# Altium project BikeLogger.PrjPcb
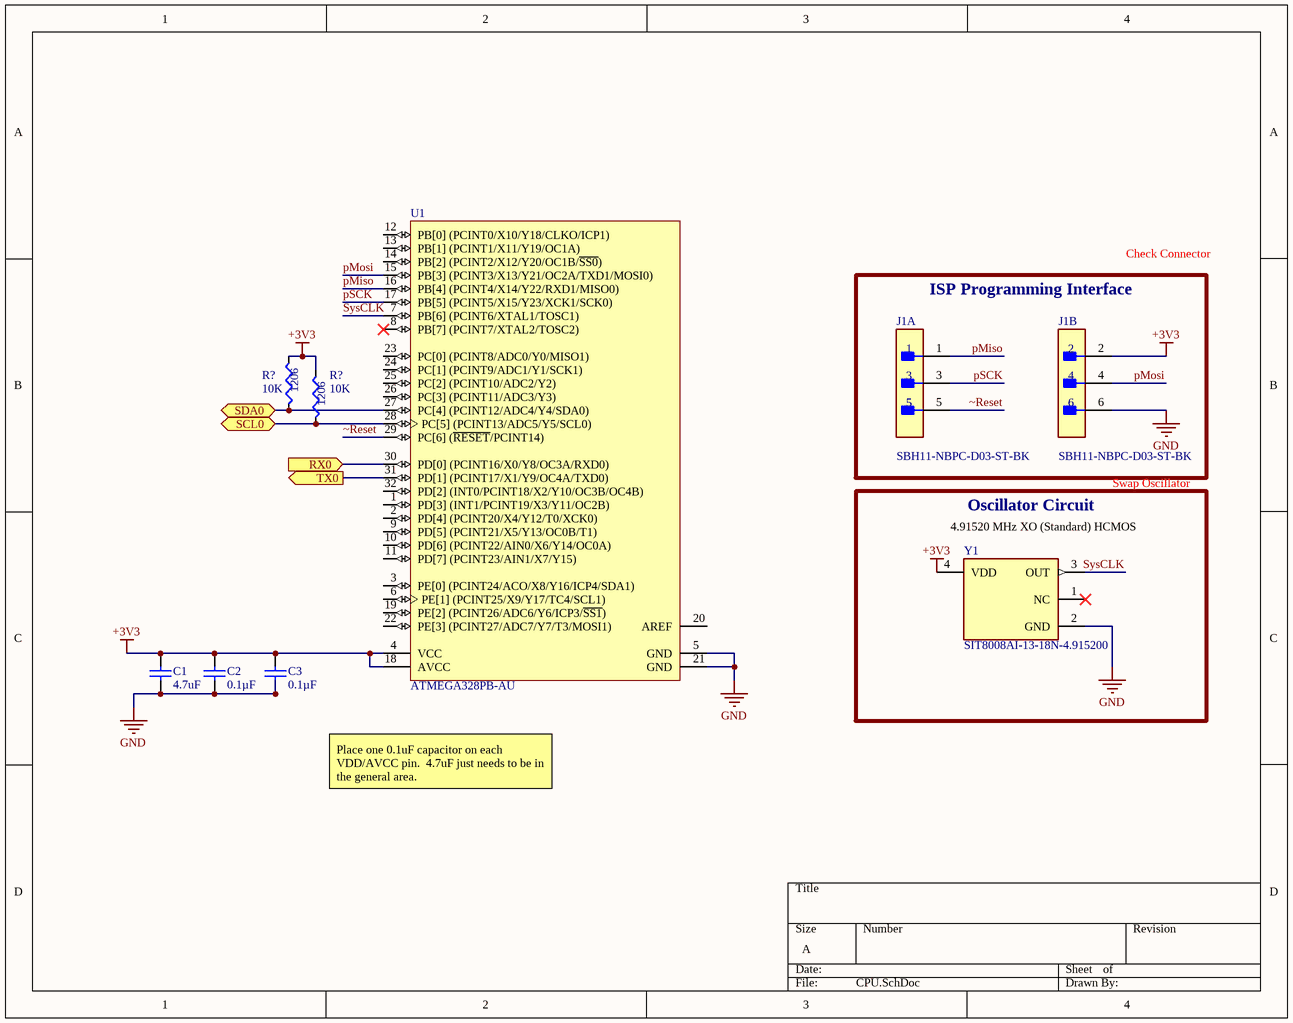
[diagram p0: CPU.SchDoc]
8 sheets, 65 parts. Net scope: flat (ports and power ports of the same name join across sheets).
Sheets:
  CPU.SchDoc
  3v3Regulator.SchDoc
  5VRegulator.SchDoc
  BikeLoggerTop.SchDoc
  Connectors.SchDoc
  DebouncedButtons.SchDoc
  GPS.SchDoc
  LEDs.SchDoc

## Sheet CPU.SchDoc
size A; SheetNumber: 2; SheetTotal: 8

### Parts
(Parts that share a designator on the sheet are numbered #1, #2 ... from top to bottom, then left to right.)
C1  4.7uF  [C1206]
C2  0.1µF  [C0603]
C3  0.1µF  [C0603]
J1  SBH11-NBPC-D03-ST-BK  [FP-SBH11-NBPC-D03-ST-BK-MFG]  (parts A,B of 2)
R?#1  10K  [R1206]
R?#2  10K  [R1206]
U1  ATMEGA328PB-AU  [ATML-32A_L]
Y1  SIT8008AI-13-18N-4.915200  [FP-SIT8008-1-MFG]

### Blocks framed on the sheet
ISP Programming Interface: J1
Oscillator Circuit: Y1

### Ports
RX0 (in), SCL0 (bidir), SDA0 (bidir), TX0 (out)

### Nets
+3V3: C1.2 C2.2 C3.2 J1.2 R?#1.2 R?#2.2 U1.4(VCC) U1.18(AVCC) Y1.4(VDD)
GND: C1.1 C2.1 C3.1 J1.6 U1.5(GND) U1.21(GND) Y1.2(GND)
pMiso: J1.1 U1.16(PB[4]_(PCINT4/X14/Y22/RXD1/MISO0))
pMosi: J1.4 U1.15(PB[3]_(PCINT3/X13/Y21/OC2A/TXD1/MOSI0))
pSCK: J1.3 U1.17(PB[5]_(PCINT5/X15/Y23/XCK1/SCK0))
SysCLK: U1.7(PB[6]_(PCINT6/XTAL1/TOSC1)) Y1.3(OUT)
~Reset: J1.5 U1.29(PC[6]_(~{RESET}/PCINT14))
NetR?#1_1: R?#1.1 U1.27(PC[4]_(PCINT12/ADC4/Y4/SDA0)) ; port SDA0
NetR?#2_1: R?#2.1 U1.28(PC[5]_(PCINT13/ADC5/Y5/SCL0)) ; port SCL0
NetU1_30: U1.30(PD[0]_(PCINT16/X0/Y8/OC3A/RXD0)) ; port RX0
NetU1_31: U1.31(PD[1]_(PCINT17/X1/Y9/OC4A/TXD0)) ; port TX0

Not connected (* = marked no-connect by the designer): U1 1(PD[3]_(INT1/PCINT19/X3/Y11/OC2B)) 2(PD[4]_(PCINT20/X4/Y12/T0/XCK0)) 3(PE[0]_(PCINT24/ACO/X8/Y16/ICP4/SDA1)) 6(PE[1]_(PCINT25/X9/Y17/TC4/SCL1)) 8(PB[7]_(PCINT7/XTAL2/TOSC2))* 9(PD[5]_(PCINT21/X5/Y13/OC0B/T1)) 10(PD[6]_(PCINT22/AIN0/X6/Y14/OC0A)) 11(PD[7]_(PCINT23/AIN1/X7/Y15)) 12(PB[0]_(PCINT0/X10/Y18/CLKO/ICP1)) 13(PB[1]_(PCINT1/X11/Y19/OC1A)) 14(PB[2]_(PCINT2/X12/Y20/OC1B/~{SS0})) 19(PE[2]_(PCINT26/ADC6/Y6/ICP3/~{SS1})) 20(AREF) 22(PE[3]_(PCINT27/ADC7/Y7/T3/MOSI1)) 23(PC[0]_(PCINT8/ADC0/Y0/MISO1)) 24(PC[1]_(PCINT9/ADC1/Y1/SCK1)) 25(PC[2]_(PCINT10/ADC2/Y2)) 26(PC[3]_(PCINT11/ADC3/Y3)) 32(PD[2]_(INT0/PCINT18/X2/Y10/OC3B/OC4B)); Y1 1(NC)*

### Notes on the sheet
- Check Connector
- Swap Oscillator
- (near Y1) 4.91520 MHz XO (Standard) HCMOS
- Place one 0.1uF capacitor on each VDD/AVCC pin.  4.7uF just needs to be in the general area.
- (in symbol CMP-024-000007-3) 1206

### Library data of the parts
C1 = CL31B475KBHNNNE: CER 4.7uF 50V X7R 1206; Made By: Brennan Swanton; Reviewed By: Carter Allen; Supplier 1: Digi-Key; Supplier Part Number 1: 587-2994-1-ND
C2 C3 = ESD35C104K4T2A-24: CAP CER 0.1UF 50V X7R 0603; Made By: Brennan Swanton; Reviewed By: *; Supplier 1: Digi-Key; Supplier Part Number 1: 478-8009-1-ND
J1 = CMP-00595-33729071-1: SBH11-NBPC-D03-ST-BK Conn Header Vert 6POS 2.54MM; Number of Contacts: 6; Connector Type: Male Pin; Current Rating: 3A; Height: 9.3mm; Row Spacing: 2.54mm; NexarPartId: 33729071; Max Operating Temperature: 105°C; RoHS: Compliant; Color: Black; Termination: Solder; Mount: Through Hole; Contact Material: Gold, Nickel; Contact Plating: Gold; Number of Rows: 2; Min Operating Temperature: -40°C; Number of Positions: 6; Pitch: 2.54mm
R?#1 R?#2 = CMP-024-000007-3: RES SMD 10K OHM 0.1% 1/4W 1206; Made By: Rita Yang; Source: Resistors.SchLib; Design Item ID: ERA-8AEB103V
U1 = CMP-2000-07439-1: AVR Microcontroller, 1.8 to 5.5 V, 32 KB Flash, 1 KB EEPROM, 2 KB SRAM, -40 to 85 degC, 32-Pin TQFP (32A), RoHS, Tray; Manufacturer: Microchip; Datasheet URL: http://ww1.microchip.com/downloads/en/DeviceDoc/40001906A.pdf; Mounting Technology: SurfaceMount; RoHSCompliant: false; Manufacturer URL: http://www.microchip.com/; Package Description: 32-Pin Thin Profile Plastic Quad Flat Package, Body 7 x 7 mm, Pitch 0.8 mm; Package Reference: 32A; Datasheet Version: Rev. A, 04/2017
Y1 = CMP-25159-009738-1: 4.91520 MHz XO (Standard) HCMOS, LVCMOS Oscillator 1.8V No Connect 4-SMD, No Lead; Manufacturer: SiTime; Max Junction Temp: +150°C; Nominal Supply Current: 3.8mA; Min Supply Voltage: 1.62V; Max Supply Voltage: 1.98V; temperature_range: Industrial, -40 to 85°C; output_drive_strength: Default; frequency_stability: ±50 ppm; voltage_supply: 1.8 V ±10%; package_size: 2.5 x 2.0 mm; Temperature Range Low: -40°C; Category: Crys; Height: 0.8mm; Package: SIT8008-1; ComponentLink2Description: Datasheet; Manufacturer Part Number: SIT8008AI-13-18N-4.915200; revision: A; Frequency: 4.91520 MHz; Temperature: -40°C to +85°C; packaging: Bulk; feature_pin: No Connect; ComponentLink2URL: https://www.sitime.com/datasheet/SiT8008; RoHS: TRUE; Lead Free: Yes; Device Class L3: Timers and Oscillators; Octopart: https://octopart.com/sit8008ai-13-18n-4.915200-sitime-102635591; Automotive: No; Temperature Range High: +85°C; octopart_url: https://octopart.com/sit8008ai-13-18n-4.915200-sitime-102635591; Device Class L1: Integrated Circuits (ICs); Device Class L2: Clock and Timing; nominal_supply_voltage: 1.8V

## Sheet 3v3Regulator.SchDoc
size B; SheetNumber: 5; SheetTotal: 6
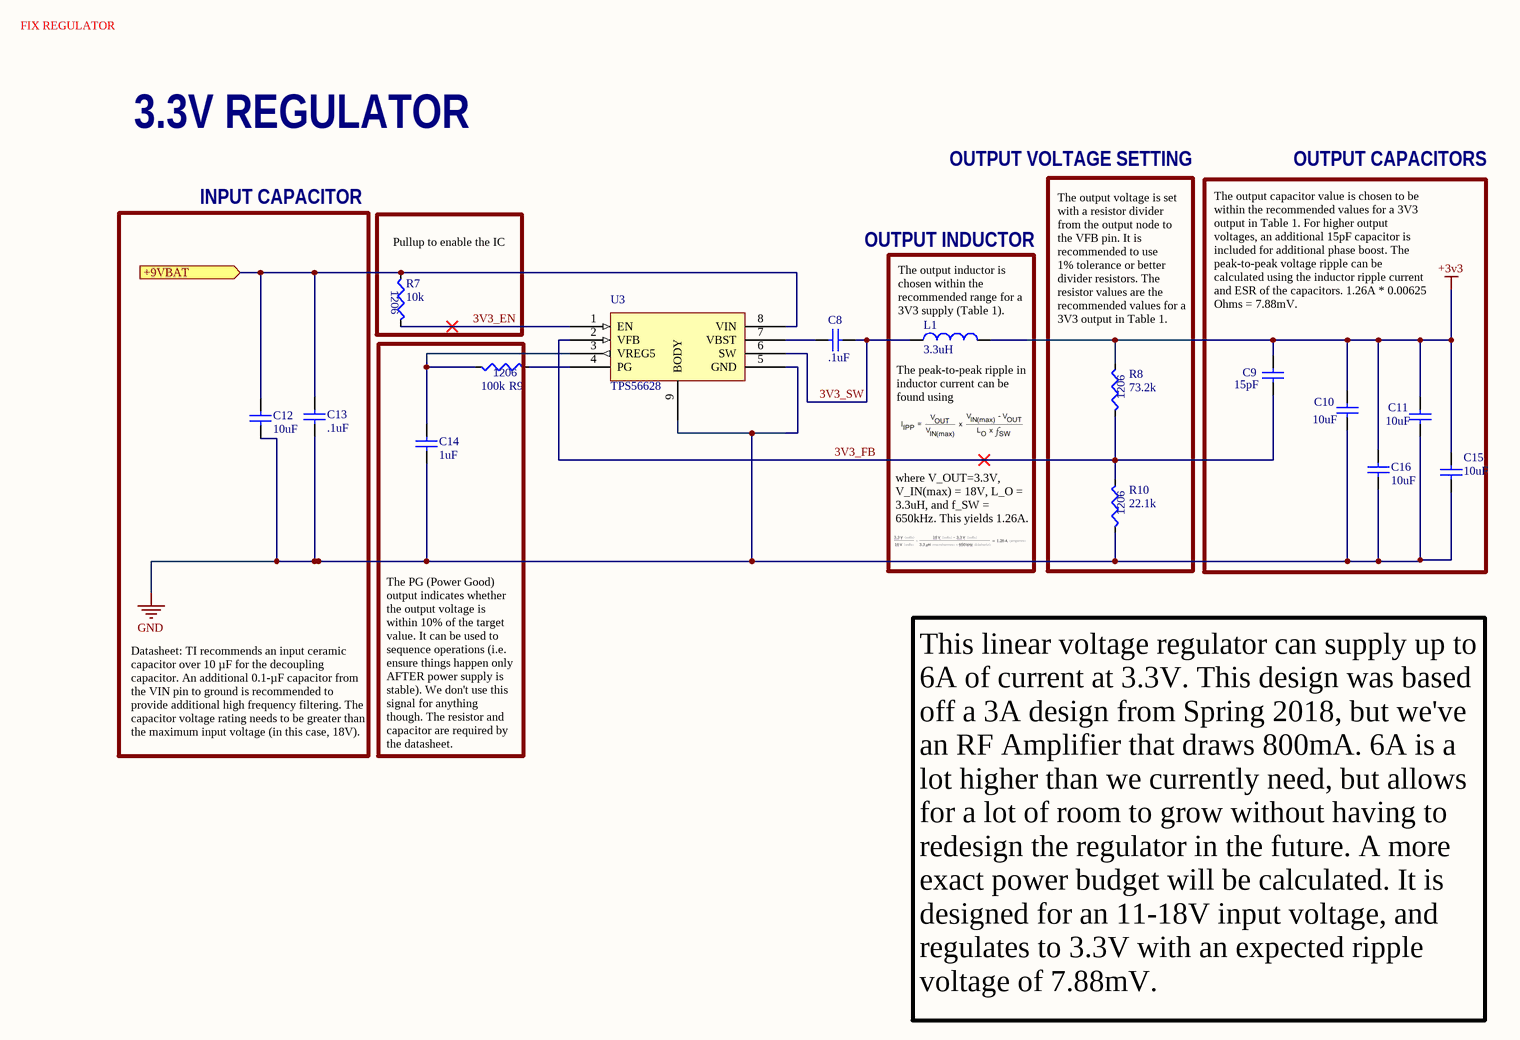
[diagram p1: 3v3Regulator.SchDoc]

### Parts
C8  .1uF  [C1206]
C9  15pF  [C1206]
C10  10uF  [C1206]
C11  10uF  [C1206]
C12  10uF  [C1206]
C13  .1uF  [C1206]
C14  1uF  [C1206]
C15  10uF  [C1206]
C16  10uF  [C1206]
L1  3.3uH  [EATON_DR125]
R7  10k  [R1206]
R8  73.2k  [R1206]
R9  100k  [R1206]
R10  22.1k  [R1206]
U3  TPS56628  [R-PDSO-G8]

### Blocks framed on the sheet
OUTPUT CAPACITORS: C9-C11 C15 C16
INPUT CAPACITOR: C12 C13

### Ports
+9VBAT (in)

### Nets
+3V3: C9.2 C10.2 C11.2 C15.2 C16.2 L1.2 R8.2
GND: C10.1 C11.1 C12.1 C13.1 C14.1 C15.1 C16.1 R10.1 U3.5(GND) U3.9(BODY)
3V3_EN: R7.2 U3.1(EN)
3V3_FB: C9.1 R8.1 R10.2 U3.2(VFB)
3V3_SW: C8.1 L1.1 U3.6(SW)
NetC8_2: C8.2 U3.7(VBST)
NetC12_2: C12.2 C13.2 R7.1 U3.8(VIN) ; port +9VBAT
NetC14_2: C14.2 R9.1 U3.3(VREG5)
NetR9_2: R9.2 U3.4(PG)

### Notes on the sheet
- FIX REGULATOR
- 3.3V REGULATOR
- OUTPUT VOLTAGE SETTING
- (near R7) Pullup to enable the IC
- OUTPUT INDUCTOR
- (near L1) The output inductor is chosen within the recommended range for a 3V3 supply (Table 1).
- (near R8) The output voltage is set with a resistor divider from the output node to the VFB pin. It is recommended to use
  1% tolerance or better divider resistors. The resistor values are the recommended values for a 3V3 output in Table 1.
- (near C9) The output capacitor value is chosen to be within the recommended values for a 3V3 output in Table 1. For higher output voltages, an additional 15pF capacitor is included for additional phase boost. The peak-to-peak voltage ripple can be calculated using the inductor ripple current and ESR of the capacitors. 1.26A * 0.00625 Ohms = 7.88mV.
- (near L1) The peak-to-peak ripple in inductor current can be found using
- where V_OUT=3.3V, V_IN(max) = 18V, L_O = 3.3uH, and f_SW = 650kHz. This yields 1.26A.
- Datasheet: TI recommends an input ceramic capacitor over 10 µF for the decoupling capacitor. An additional 0.1-µF capacitor from the VIN pin to ground is recommended to provide additional high frequency filtering. The capacitor voltage rating needs to be greater than the maximum input voltage (in this case, 18V).
- The PG (Power Good) output indicates whether the output voltage is within 10% of the target value. It can be used to sequence operations (i.e. ensure things happen only AFTER power supply is stable). We don't use this signal for anything though. The resistor and capacitor are required by the datasheet.
- This linear voltage regulator can supply up to 6A of current at 3.3V. This design was based off a 3A design from Spring 2018, but we've an RF Amplifier that draws 800mA. 6A is a lot higher than we currently need, but allows for a lot of room to grow without having to redesign the regulator in the future. A more exact power budget will be calculated. It is designed for an 11-18V input voltage, and regulates to 3.3V with an expected ripple voltage of 7.88mV.
- (in symbol ERJ-8ENF1002V) 1206
- (in symbol ERJ-8ENF1003V) 1206
- (in symbol ERJ-8ENF2212V) 1206
- (in symbol ERJ-8ENF7322V) 1206

### Library data of the parts
C8 C13 = CL31B104KBCNNNC: CAP CER 0.1UF 50V C0G/NP0 1206; Made By: Brennan Swanton; Reviewed By: Carter Allen; Supplier 1: Digi-Key; Supplier Part Number 1: 490-8335-1-ND
C9 = C1206C150K5GACTU: CAP CER 15PF 50V C0G/NP0 1206; Supplier 1: Digi-Key; Supplier Part Number 1: 399-9314-1-ND
C10-C12 C15 C16 = CL31B106KLHNNNE: CER 10UF 35V X7R 1206; Made By: Brennan Swanton; Reviewed By: Carter Allen; Supplier 1: Digi-Key; Supplier Part Number 1: 587-3007-1-ND
C14 = CL31B105KBHNNNE: CER 1UF 50V X7R 1206; Made By: Brennan Swanton; Reviewed By: Carter Allen; Supplier 1: Digi-Key; Supplier Part Number 1: 399-8147-1-ND
L1 = DR125-3R3-R: Inductor 3.3uH 9.26A 20%; Supplier 1: Digi-Key; Supplier Part Number 1: 513-1529-1-ND
R7 = ERJ-8ENF1002V: 10K OHM 1% 1/4W 1206; Made By: Brennan Swanton; Reviewed By: Carter Allen; Supplier 1: Digi-Key; Supplier Part Number 1: 541-2247-1-ND
R8 = ERJ-8ENF7322V: 73.2K OHM 1% 1/4W 1206; Made By: Raphael Navarro; Reviewed By: No one, yet; Supplier 1: Digi-Key; Supplier Part Number 1: P73.2KFCT-ND
R9 = ERJ-8ENF1003V: 100K OHM 1% 1/4W 1206; Made By: Brennan Swanton; Reviewed By: Carter Allen; Supplier 1: Digi-Key; Supplier Part Number 1: P100KFCT-ND
R10 = ERJ-8ENF2212V: 22.1K OHM 1% 1/4W 1206; Supplier 1: Digi-Key; Supplier Part Number 1: P22.1KFCT-ND
U3 = TPS56628: Buck Regulator IC Adj. 6A 4.5V-18V Input; Supplier 1: Digi-Key; Supplier Part Number 1: 296-40815-1-ND

## Sheet 5VRegulator.SchDoc
size B; SheetNumber: 6; SheetTotal: 6
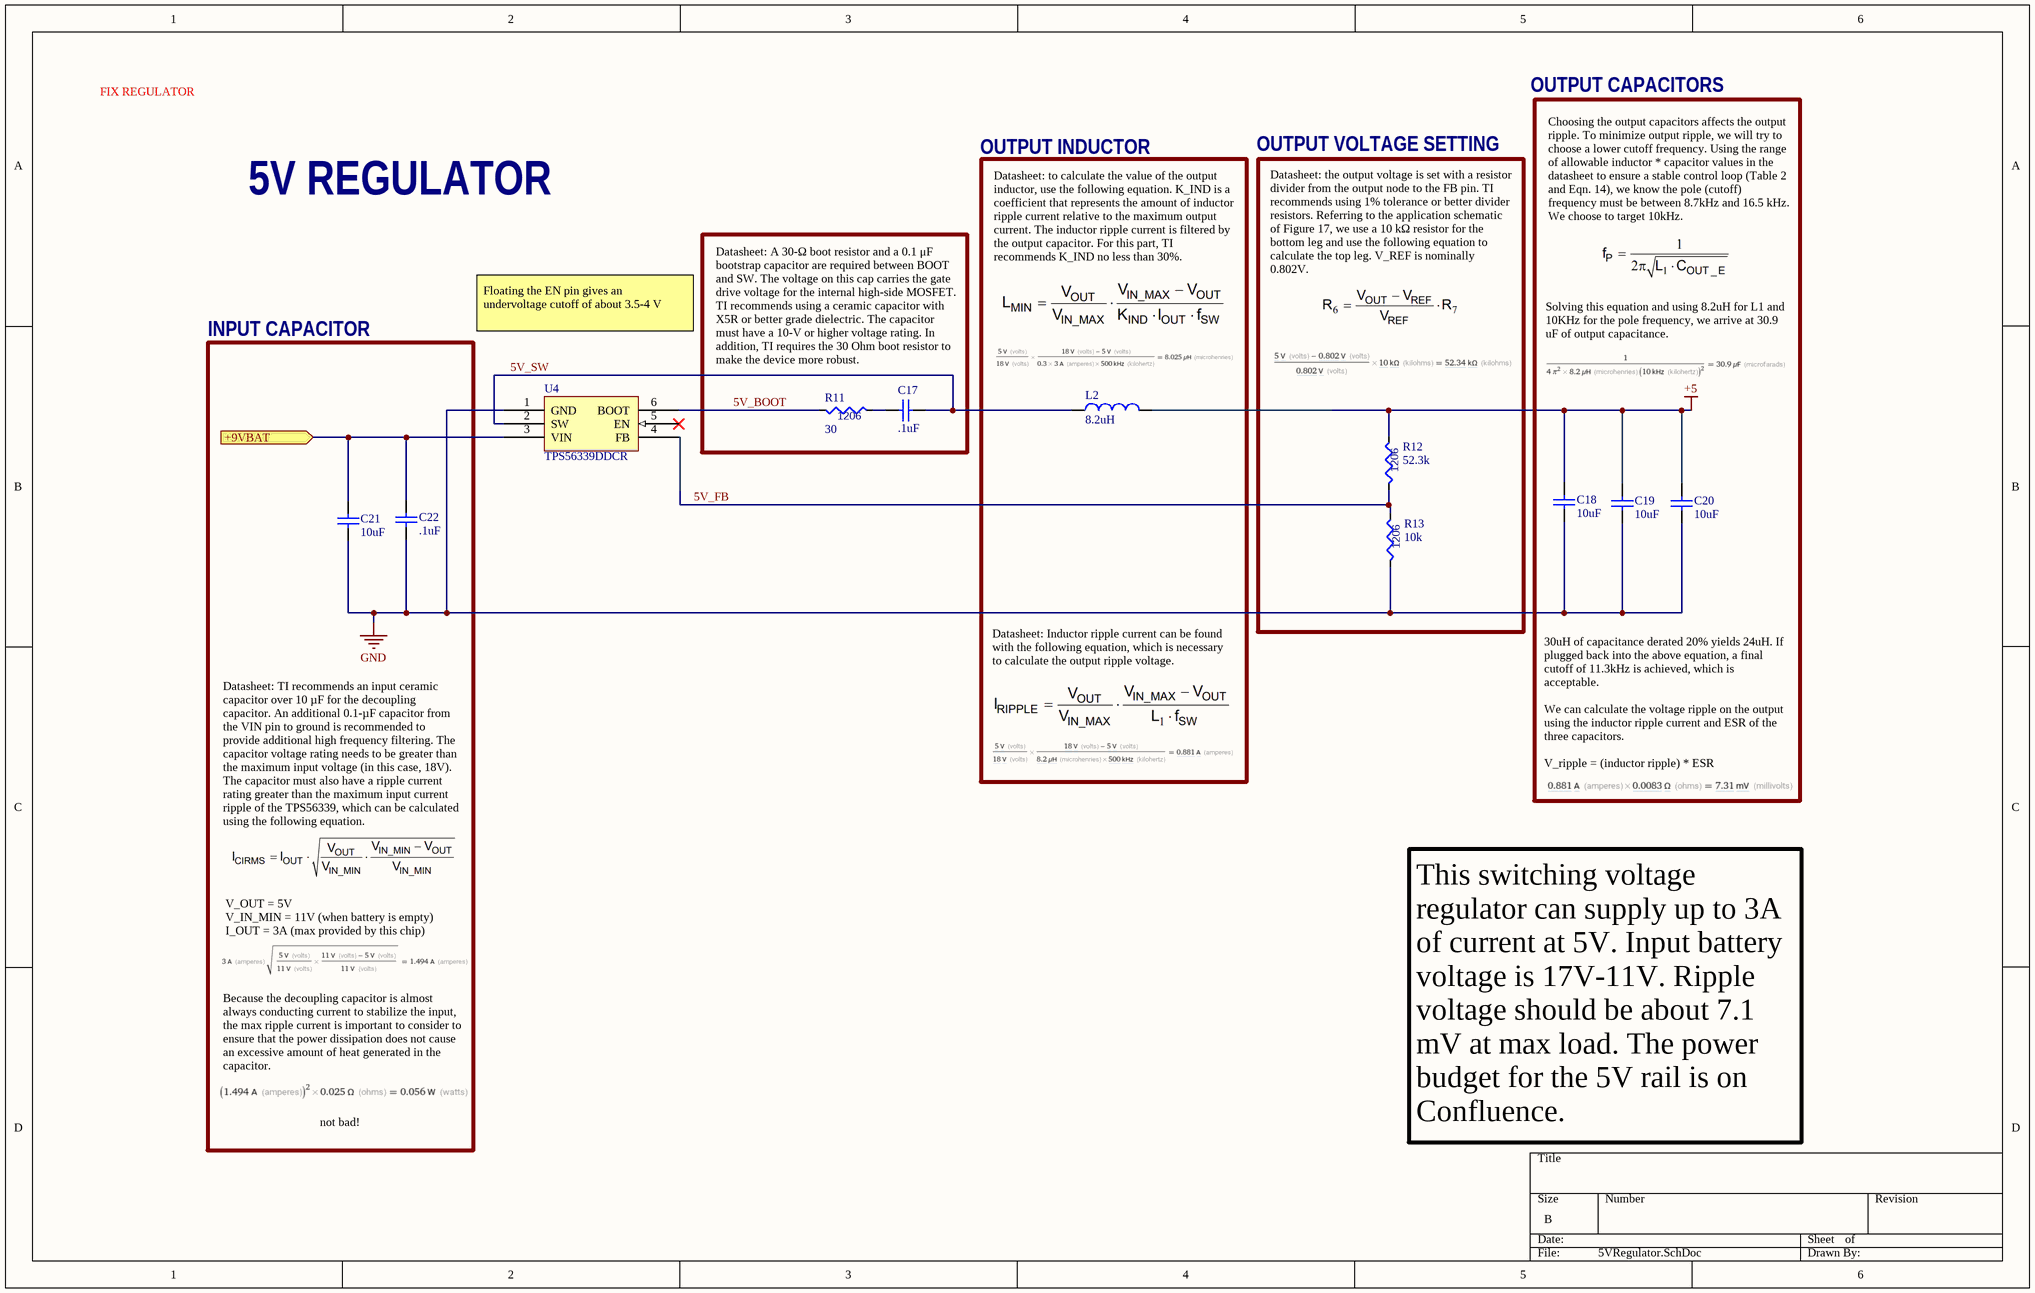
[diagram p2: 5VRegulator.SchDoc]

### Parts
C17  .1uF  [C1206]
C18  10uF  [C1206]
C19  10uF  [C1206]
C20  10uF  [C1206]
C21  10uF  [C1206]
C22  .1uF  [C1206]
L2  8.2uH  [EATON_HCMA0703]
R11  30  [R1206]
R12  52.3k  [R1206]
R13  10k  [R1206]
U4  TPS56339DDCR  [TSOT-23-6]

### Blocks framed on the sheet
OUTPUT INDUCTOR: L2
OUTPUT VOLTAGE SETTING: R12 R13
INPUT CAPACITOR: C21 C22

### Ports
+9VBAT (in)

### Nets
+5: C18.2 C19.2 C20.2 L2.2 R12.2
GND: C18.1 C19.1 C20.1 C21.1 C22.1 R13.1 U4.1(GND)
5V_BOOT: R11.1 U4.6(BOOT)
5V_FB: R12.1 R13.2 U4.4(FB)
5V_SW: C17.2 L2.1 U4.2(SW)
NetC12_2: C21.2 C22.2 U4.3(VIN) ; port +9VBAT
NetC17_1: C17.1 R11.2

Not connected (* = marked no-connect by the designer): U4 5(EN)*

### Notes on the sheet
- FIX REGULATOR
- OUTPUT CAPACITORS
- 5V REGULATOR
- Choosing the output capacitors affects the output ripple. To minimize output ripple, we will try to choose a lower cutoff frequency. Using the range of allowable inductor * capacitor values in the datasheet to ensure a stable control loop (Table 2 and Eqn. 14), we know the pole (cutoff) frequency must be between 8.7kHz and 16.5 kHz. We choose to target 10kHz.
- Datasheet: to calculate the value of the output inductor, use the following equation. K_IND is a coefficient that represents the amount of inductor ripple current relative to the maximum output current. The inductor ripple current is filtered by the output capacitor. For this part, TI recommends K_IND no less than 30%.
- Datasheet: the output voltage is set with a resistor divider from the output node to the FB pin. TI recommends using 1% tolerance or better divider resistors. Referring to the application schematic of Figure 17, we use a 10 kΩ resistor for the bottom leg and use the following equation to calculate the top leg. V_REF is nominally 0.802V.
- Floating the EN pin gives an undervoltage cutoff of about 3.5-4 V
- Datasheet: A 30-Ω boot resistor and a 0.1 μF bootstrap capacitor are required between BOOT and SW. The voltage on this cap carries the gate drive voltage for the internal high-side MOSFET. TI recommends using a ceramic capacitor with X5R or better grade dielectric. The capacitor must have a 10-V or higher voltage rating. In addition, TI requires the 30 Ohm boot resistor to make the device more robust.
- Solving this equation and using 8.2uH for L1 and 10KHz for the pole frequency, we arrive at 30.9 uF of output capacitance.
- Datasheet: Inductor ripple current can be found with the following equation, which is necessary to calculate the output ripple voltage.
- 30uH of capacitance derated 20% yields 24uH. If plugged back into the above equation, a final cutoff of 11.3kHz is achieved, which is acceptable.
  We can calculate the voltage ripple on the output using the inductor ripple current and ESR of the three capacitors.
  V_ripple = (inductor ripple) * ESR
- Datasheet: TI recommends an input ceramic capacitor over 10 µF for the decoupling capacitor. An additional 0.1-µF capacitor from the VIN pin to ground is recommended to provide additional high frequency filtering. The capacitor voltage rating needs to be greater than the maximum input voltage (in this case, 18V). The capacitor must also have a ripple current rating greater than the maximum input current ripple of the TPS56339, which can be calculated using the following equation.
- V_OUT = 5V
  V_IN_MIN = 11V (when battery is empty)
  I_OUT = 3A (max provided by this chip)
- Because the decoupling capacitor is almost always conducting current to stabilize the input, the max ripple current is important to consider to ensure that the power dissipation does not cause an excessive amount of heat generated in the capacitor.
- not bad!
- This switching voltage regulator can supply up to 3A of current at 5V. Input battery voltage is 17V-11V. Ripple voltage should be about 7.1 mV at max load. The power budget for the 5V rail is on Confluence.
- (in symbol ERA-8AEB5232V) 1206
- (in symbol ERA-8AHD300V) 1206
- (in symbol ERJ-8ENF1002V) 1206

### Library data of the parts
C17 C22 = CL31B104KBCNNNC: as C8 on sheet 3v3Regulator; Supplier 1: Digi-Key; Supplier Part Number 1: 490-8335-1-ND
C18-C21 = CL31B106KLHNNNE: as C10 on sheet 3v3Regulator; Supplier 1: Digi-Key; Supplier Part Number 1: 587-3007-1-ND
L2 = HCMA0703-8R2-R: Inductor 8.2uH 4A 20%; Supplier 1: Digi-Key; Supplier Part Number 1: 283-4539-1-ND
R11 = ERA-8AHD300V: RES SMD 30 OHM 0.5% 1/4W 1206; Made By: Jamie; Reviewed By: Raphael; Supplier 1: Digi-Key; Supplier Part Number 1: P123726CT-ND
R12 = ERA-8AEB5232V: RES SMD 52.3K OHM 0.1% 1/4W 1206; Made By: Raphael Navarro; Reviewed By: Jamie Smith; Supplier 1: Digi-Key; Supplier Part Number 1: P52.3KBCCT-ND
R13 = ERJ-8ENF1002V: as R7 on sheet 3v3Regulator; Supplier 1: Digi-Key; Supplier Part Number 1: 541-2247-1-ND
U4 = TPS56339DDCR: Buck Regulator IC Adj. 3A 4.5V-24V Input; Supplier 1: Digi-Key; Supplier Part Number 1: 296-53568-1-ND

## Sheet BikeLoggerTop.SchDoc
size B; SheetNumber: 7; SheetTotal: 8

## Sheet Connectors.SchDoc
size A; SheetNumber: 5; SheetTotal: 8
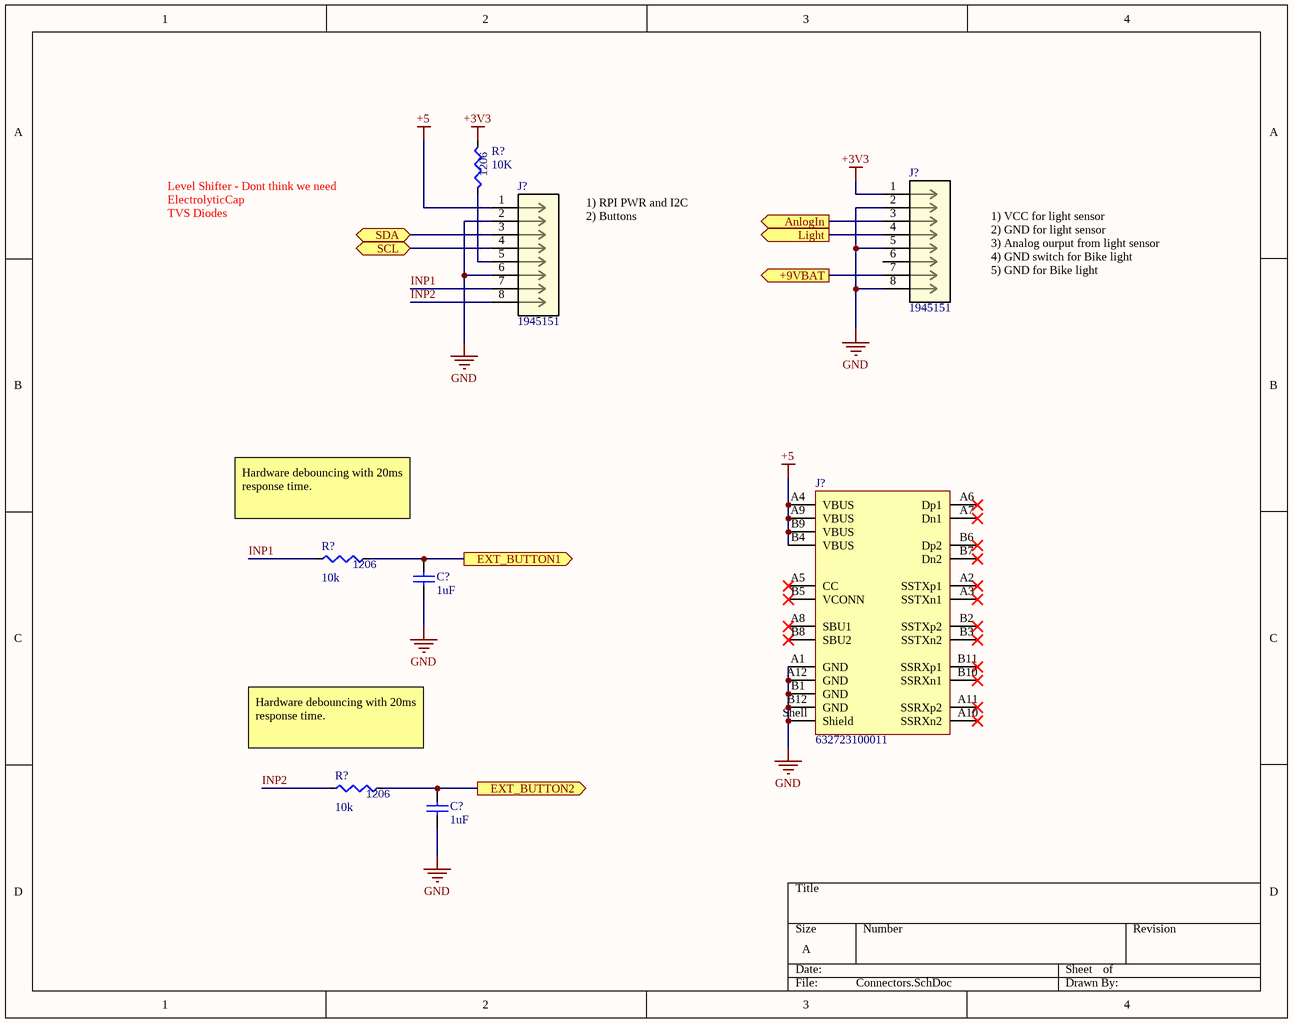
[diagram p3: Connectors.SchDoc]

### Parts
(Parts that share a designator on the sheet are numbered #1, #2 ... from top to bottom, then left to right.)
C?#1  1uF  [C1206]
C?#2  1uF  [C1206]
J?#1  1945151  [1945151-Footprint-1]
J?#2  1945151  [1945151-Footprint-1]
J?#3  632723100011  [632723100011]
R?#3  10K  [R1206]
R?#4  10k  [R1206]
R?#5  10k  [R1206]

### Ports
+9VBAT (out), AnlogIn (out), EXT_BUTTON1 (out), EXT_BUTTON2 (out), Light (out), SCL (bidir), SDA (bidir)

### Nets
+3V3: J?#1.1 R?#3.2
+5: J?#2.1 J?#3.A4(VBUS) J?#3.A9(VBUS) J?#3.B4(VBUS) J?#3.B9(VBUS)
GND: C?#1.1 C?#2.1 J?#1.2 J?#1.5 J?#1.8 J?#2.2 J?#2.6 J?#3.A1(GND) J?#3.A12(GND) J?#3.B1(GND) J?#3.B12(GND) J?#3.Shell(Shield)
INP1: J?#2.7 R?#4.2
INP2: J?#2.8 R?#5.2
NetC12_2: J?#1.7 ; port +9VBAT
NetC?#1_2: C?#1.2 R?#4.1 ; port EXT_BUTTON1
NetC?#2_2: C?#2.2 R?#5.1 ; port EXT_BUTTON2
NetJ?#1_3: J?#1.3 ; port AnlogIn
NetJ?#1_4: J?#1.4 ; port Light
NetJ?#2_3: J?#2.3 ; port SDA
NetJ?#2_4: J?#2.4 ; port SCL
NetJ?#2_5: J?#2.5 R?#3.1

Not connected (* = marked no-connect by the designer): J?#1 6; J?#3 A2(SSTXp1)* A3(SSTXn1)* A5(CC)* A6(Dp1)* A7(Dn1)* A8(SBU1)* A10(SSRXn2)* A11(SSRXp2)* B2(SSTXp2)* B3(SSTXn2)* B5(VCONN)* B6(Dp2)* B7(Dn2)* B8(SBU2)* B10(SSRXn1)* B11(SSRXp1)*

### Notes on the sheet
- Level Shifter - Dont think we need
- ElectrolyticCap
- TVS Diodes
- 1) RPI PWR and I2C
- 2) Buttons
- 1) VCC for light sensor
- 2) GND for light sensor
- 3) Analog ourput from light sensor
- 4) GND switch for Bike light
- 5) GND for Bike light
- Hardware debouncing with 20ms response time.
- (in symbol CMP-024-000007-3) 1206
- (in symbol CMP-024-000034-3) 1206

### Library data of the parts
C?#1 C?#2 = CMP-054-000013-3: CER 1UF 50V X7R 1206; Made by: Brennan Swanton; Reviewed by: Carter Allen; Supplier Part Number 1: 399-C1206C105K5RAC7800CT-ND; Source: Capacitors.SchLib; Design Item ID: CL31B105KBHNNNE; Supplier 1: Digi-Key
J?#1 J?#2 = CMP-00102-1: Strip Terminal Block, 8A, 1 Row(s), 1 Deck(s); Voltage Rating: 160V; Number of Ways: 8; Number of Decks: 1; Fastening Method: SOLDER; Safety Approval: UL; Current Rating: 8A; Reach SVHC Compliant: Yes; Mount: Board; Number of Rows: 1; RoHS Compliant: Yes; Terminal and Terminal Block Type: STRIP TERMINAL BLOCK
J?#3 = CMP-1502-03213-3: NexarPartId: 68112674; Voltage Rating: 20V; Gender: Receptacle; Current Rating: 5A; Pin Length: 1.5mm; Contact Resistance: 30mΩ; Connector Type: USB; USB Standard: USB 3.1; Insulation Resistance: 1GΩ; Number of Contacts: 24; Contact Material: Gold, Nickel; Max Operating Temperature: 105°C; Packaging: Tape and Reel; Height: 3.16mm; RoHS: Compliant; Orientation: Horizontal; Mount: Surface Mount, Through Hole; Number of Pins: 24; Min Operating Temperature: -40°C
R?#3 = CMP-024-000007-3: as R?#1 on sheet CPU; Source: Resistors.SchLib; Design Item ID: ERA-8AEB103V
R?#4 R?#5 = CMP-024-000034-3: 10K OHM 1% 1/4W 1206; Made By: Brennan Swanton; Reviewed By: Carter Allen; Supplier 1: Digi-Key; Supplier Part Number 1: 541-2247-1-ND; Source: Resistors.SchLib; Design Item ID: ERJ-8ENF1002V

## Sheet DebouncedButtons.SchDoc
size A; SheetNumber: 6; SheetTotal: 8
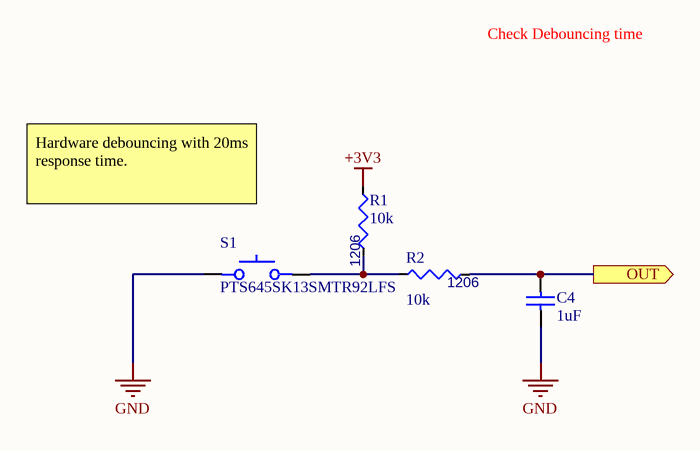
[diagram p4: DebouncedButtons.SchDoc]

### Parts
C4  1uF  [C1206]
R1  10k  [R1206]
R2  10k  [R1206]
S1  PTS645SK13SMTR92LFS  [PTS645SK13SMTR92LFS-Footprint-1]

### Ports
OUT (out)

### Nets
+3V3: R1.2
GND: C4.1 S1.2
NetC4_2: C4.2 R2.1 ; port OUT
NetR1_1: R1.1 R2.2 S1.1

### Notes on the sheet
- Check Debouncing time
- Hardware debouncing with 20ms response time.
- (in symbol CMP-024-000034-3) 1206

### Library data of the parts
C4 = CMP-054-000013-3: as C?#1 on sheet Connectors; Supplier Part Number 1: 399-C1206C105K5RAC7800CT-ND; Source: Capacitors.SchLib; Design Item ID: CL31B105KBHNNNE; Supplier 1: Digi-Key
R1 R2 = CMP-024-000034-3: as R?#4 on sheet Connectors; Supplier 1: Digi-Key; Supplier Part Number 1: 541-2247-1-ND; Source: Resistors.SchLib; Design Item ID: ERJ-8ENF1002V
S1 = CMP-00027-00000-6: SWITCH TACTILE SPST-NO 0.05A 12V; Manufacturer: Digi-Key; Made By: Victor; Supplier Part Number: CKN10817CT-ND; Design Item ID: PTS645SK13SMTR92LFS

## Sheet GPS.SchDoc
size A; SheetNumber: 7; SheetTotal: 8
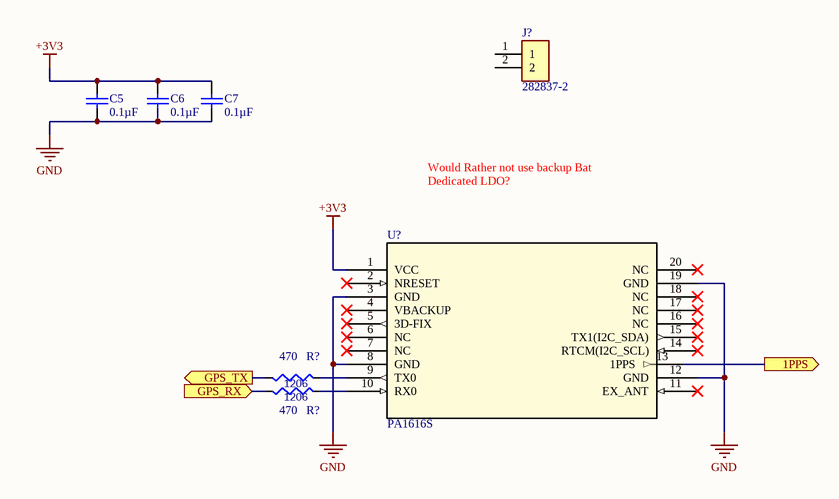
[diagram p5: GPS.SchDoc]

### Parts
(Parts that share a designator on the sheet are numbered #1, #2 ... from top to bottom, then left to right.)
C5  0.1µF  [C0603]
C6  0.1µF  [C0603]
C7  0.1µF  [C0603]
J?#4  282837-2  [Model Name]
R?#6  470  [R1206]
R?#7  470  [R1206]
U?  PA1616S  [PA1616S-Footprint-1]

### Ports
1PPS (out), GPS_RX (in), GPS_TX (out)

### Nets
+3V3: C5.2 C6.2 C7.2 U?.1(VCC)
GND: C5.1 C6.1 C7.1 U?.3(GND) U?.8(GND) U?.12(GND) U?.19(GND)
NetR?#6_1: R?#6.1 ; port GPS_TX
NetR?#6_2: R?#6.2 U?.9(TX0)
NetR?#7_1: R?#7.1 ; port GPS_RX
NetR?#7_2: R?#7.2 U?.10(RX0)
NetU?_13: U?.13(1PPS) ; port 1PPS

Not connected (* = marked no-connect by the designer): J?#4 1 2; U? 2(NRESET)* 4(VBACKUP)* 5(3D-FIX)* 6(NC)* 7(NC)* 11(EX_ANT)* 14(RTCM(I2C_SCL))* 15(TX1(I2C_SDA))* 16(NC)* 17(NC)* 18(NC)* 20(NC)*

### Notes on the sheet
- Would Rather not use backup Bat
- Dedicated LDO?
- (in symbol CMP-024-000067-4) 1206

### Library data of the parts
C5-C7 = ESD35C104K4T2A-24: as C2 on sheet CPU; Reviewed By: *; Supplier 1: Digi-Key; Supplier Part Number 1: 478-8009-1-ND
R?#6 R?#7 = CMP-024-000067-4: 470 OHM 1% 1/4W 1206; Made By: Jamie Smith; Source: Resistors.SchLib; Supplier Part Number 1: P470FCT-ND; Supplier 1: Digi-Key; Design Item ID: ERJ-8ENF4700V
U? = CMP-00103-1: Ultimate GPS Module - 66 channel w/10 Hz updates - PA1616S - MTK3339 Chipset; Part Number: 790; Supplier: adafruit

## Sheet LEDs.SchDoc
size A; SheetNumber: 3; SheetTotal: 8
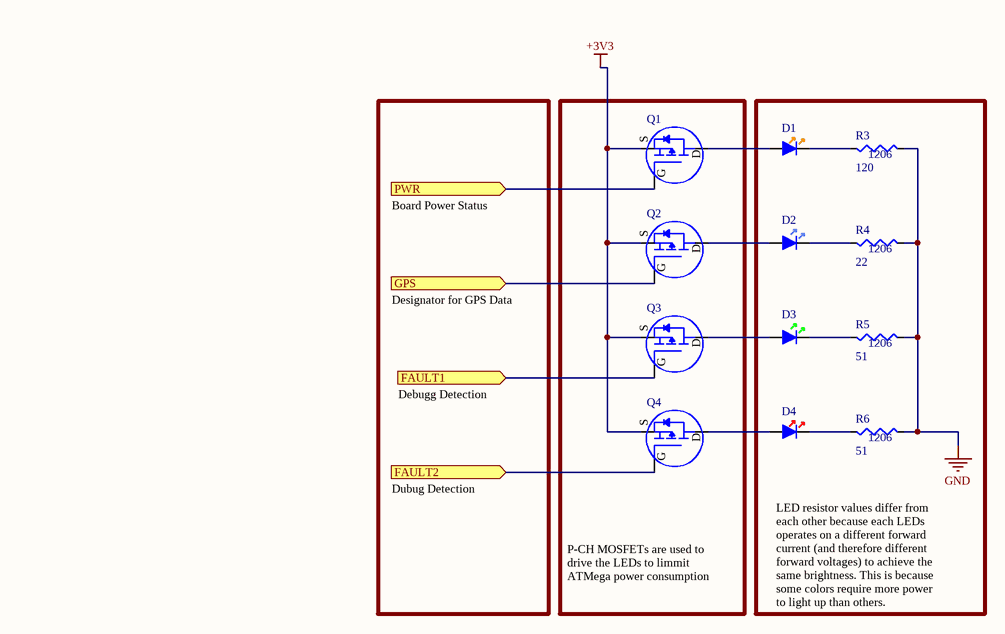
[diagram p6: LEDs.SchDoc]

### Parts
D1  350-1556-ND  [350-1556-ND-Footprint-1]  (value not drawn)
D2  151033BS03000  [Type 3mm]  (value not drawn)
D3  151031VS04000  [Type 3mm]  (value not drawn)
D4  151031SS06000  [Type 3mm]  (value not drawn)
Q1  BSS84  [SOT23]  (value not drawn)
Q2  BSS84  [SOT23]  (value not drawn)
Q3  BSS84  [SOT23]  (value not drawn)
Q4  BSS84  [SOT23]  (value not drawn)
R3  120  [R1206]
R4  22  [R1206]
R5  51  [R1206]
R6  51  [R1206]

### Ports
FAULT1 (in), FAULT2 (in), GPS (in), PWR (in)

### Nets
+3V3: Q1.2(S) Q2.2(S) Q3.2(S) Q4.2(S)
GND: R3.2 R4.2 R5.2 R6.2
NetD1_1: D1.1 R3.1
NetD1_2: D1.2 Q1.3(D)
NetD2_1: D2.1 R4.1
NetD2_2: D2.2 Q2.3(D)
NetD3_1: D3.1 R5.1
NetD3_2: D3.2 Q3.3(D)
NetD4_1: D4.1 R6.1
NetD4_2: D4.2 Q4.3(D)
NetQ1_1: Q1.1(G) ; port PWR
NetQ2_1: Q2.1(G) ; port GPS
NetQ3_1: Q3.1(G) ; port FAULT1
NetQ4_1: Q4.1(G) ; port FAULT2

### Notes on the sheet
- Board Power Status
- Designator for GPS Data
- Debugg Detection
- Dubug Detection
- P-CH MOSFETs are used to drive the LEDs to limmit ATMega power consumption
- LED resistor values differ from each other because each LEDs operates on a different forward current (and therefore different forward voltages) to achieve the same brightness. This is because some colors require more power to light up than others.
- (in symbol CMP-024-000041-3) 1206
- (in symbol CMP-024-000052-3) 1206
- (in symbol CMP-024-000074-4) 1206

### Library data of the parts
D1 = CMP-00044-1: LED ORANGE DIFFUSED 3MM T/H; Dominant Wavelength: 602nm; Number of Elements: 1; Current Rating: 25mA; Test Current: 10mA; Lens Style: Round,Domed,Diffused; Luminous Intensity: 7mcd; Power Dissipation: 135mW; Viewing Angle: 60°; Forward Voltage: 2.2V; Wavelength: 600nm; Made By: Elliott Meeks; Lens Size: 3mm; Height: 6mm; Reach SVHC Compliant: No; RoHS Compliant: Yes; Depth: 3.2mm; Supplier Part Number 1: 350-1556-ND; Radiation Hardening: No; Supplier 1: DigiKey; Diameter: 2.92mm; Packaging: Bulk; Length: 3.2mm; Mount: Through Hole; Series: 521; Lead Free: Lead Free; Lens Transparency: Diffused; Min Operating Temperature: -55°C; Case/Package: Radial; Lens Color: Orange; Number of LEDs: 1; Forward Current: 10mA; Number of Pins: 2; Max Operating Temperature: 100°C; Color: Orange
D2 = CMP-00043-1: Led, Blue, T-1 (3Mm), 470 Nm, 2.8 V, 30 Ma, 3.8 Cd Rohs Compliant: Yes; Viewing Angle: 30°; Forward Voltage: 2.8V; Forward Current: 30mA; Luminous Intensity: 3800mcd; Lens Color: Colorless; Test Current: 20mA; Lens Style: Round,Domed,Circular; Wavelength: 470nm; Lens Transparency: Clear; Series: WL-TMRW; Lens Size: 3mm; Mount: Through Hole; Reach SVHC Compliant: Unknown; Color: Blue; Case/Package: Radial; RoHS Compliant: Yes; Max Operating Temperature: 85°C; Height: 5.55mm; Dominant Wavelength: 470nm; Min Operating Temperature: -40°C
D3 = CMP-00028-6: Led, Green, T-1 (3Mm), 570 Nm, 2.1 V, 30 Ma, 120 Mcd Rohs Compliant: Yes; Lens Style: Round,Domed,Circular; Forward Voltage: 2.1V; Viewing Angle: 40°; Lens Transparency: Diffused; Test Current: 20mA; Forward Current: 30mA; Made By:: Adam Lewczuk; Wavelength: 570nm; Luminous Intensity: 120mcd; Packaging: Bulk; Color: Green; Max Operating Temperature: 85°C; Mount: Through Hole; Min Operating Temperature: -40°C; Height: 5.55mm; Lens Size: 3mm; Case/Package: Radial; Series: WL-TMRC; Lens Color: Green; Dominant Wavelength: 570nm; Package Quantity: 1; RoHS Compliant: Yes
D4 = CMP-00041-3: Led, Red, T-1 (3Mm), 630 Nm, 1.8 V, 30 Ma, 20 Mcd Rohs Compliant: Yes; Lens Style: Round,Domed,Circular; Dominant Wavelength: 640nm; Forward Voltage: 2.2V; Test Current: 20mA; Lens Transparency: Diffused; Wavelength: 630nm; Forward Current: 30mA; Viewing Angle: 60°; Luminous Intensity: 35mcd; Case/Package: Radial; Max Operating Temperature: 85°C; Min Operating Temperature: -40°C; Color: Red; RoHS Compliant: Yes; Reach SVHC Compliant: Unknown; Mount: Through Hole; Lens Size: 3mm; Lens Color: Red; Series: WL-TMRC; Height: 5.55mm
Q1-Q4 = CMP-056-000000-1: MOSFET P-CH 50V 130MA SOT-23; Made by: Brennan Swanton; Reviewed by: *; Container: *; Quantity: *; Bin: *; Design Item ID: BSS84; Source: Transistors.SchLib
R3 = CMP-024-000041-3: 120 OHM 1% 1/4W 1206; Reviewed By: Carter Allen; Made By: Brennan Swanton; Design Item ID: ERJ-8ENF1200V; Source: Resistors.SchLib
R4 = CMP-024-000052-3: 22 OHM 1% 1/4W 1206; Reviewed By: Carter Allen; Made By: Brennan Swanton; Source: Resistors.SchLib; Design Item ID: ERJ-8ENF22R0V
R5 R6 = CMP-024-000074-4: 51 OHM 1% 1/4W 1206; Made By: Jamie Smith; Source: Resistors.SchLib; Design Item ID: ERJ-8ENF51R0V

## Nets that join several sheets
+3V3: CPU (9 pins), 3v3Regulator (7 pins), Connectors (J?#1.1 R?#3.2), DebouncedButtons (R1.2), GPS (C5.2 C6.2 C7.2 U?.1), LEDs (Q1.2 Q2.2 Q3.2 Q4.2)
+5: 5VRegulator (5 pins), Connectors (5 pins)
GND: CPU (7 pins), 3v3Regulator (10 pins), 5VRegulator (7 pins), Connectors (12 pins), DebouncedButtons (C4.1 S1.2), GPS (7 pins), LEDs (R3.2 R4.2 R5.2 R6.2)
NetC12_2: 3v3Regulator (C12.2 C13.2 R7.1 U3.8), 5VRegulator (C21.2 C22.2 U4.3), Connectors (J?#1.7)